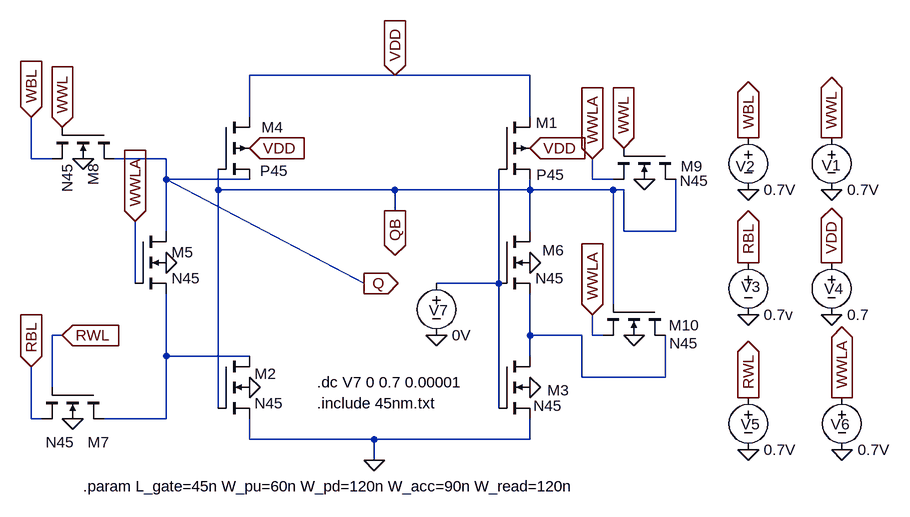
[diagram p0: schematic SNM_Test.asc]
SNM_Test.asc, the LTspice schematic file:
Version 4.1
SHEET 1 1680 680
WIRE 160 -32 -64 -32
WIRE 368 -32 160 -32
WIRE -64 32 -64 -32
WIRE 368 32 368 -32
WIRE -400 96 -400 32
WIRE -368 96 -400 96
WIRE -192 96 -272 96
WIRE -192 128 -192 96
WIRE -64 128 -192 128
WIRE 464 128 464 96
WIRE 496 128 464 128
WIRE -112 144 -112 112
WIRE 160 144 -112 144
WIRE 368 144 368 128
WIRE 368 144 160 144
WIRE 496 144 368 144
WIRE 512 144 496 144
WIRE 160 176 160 144
WIRE -192 208 -192 128
WIRE 368 208 368 144
WIRE 512 208 512 144
WIRE 592 208 592 128
WIRE 592 208 512 208
WIRE -240 288 -240 192
WIRE 112 288 -192 128
WIRE 320 288 320 112
WIRE 320 288 224 288
WIRE 496 320 496 144
WIRE -352 368 -368 368
WIRE 368 368 368 304
WIRE 448 368 368 368
WIRE 464 368 464 336
WIRE 480 368 464 368
WIRE -192 400 -192 304
WIRE -64 400 -192 400
WIRE 368 400 368 368
WIRE 448 432 448 368
WIRE 576 432 576 368
WIRE 576 432 448 432
WIRE -368 448 -368 368
WIRE -112 480 -112 144
WIRE 320 480 320 288
WIRE -400 496 -400 416
WIRE -384 496 -400 496
WIRE -192 496 -192 400
WIRE -192 496 -288 496
WIRE -64 528 -64 496
WIRE 128 528 -64 528
WIRE 368 528 368 496
WIRE 368 528 128 528
WIRE 128 560 128 528
FLAG -400 32 WBL
IOPIN -400 32 In
FLAG -400 416 RBL
IOPIN -400 416 In
FLAG -240 192 WWLA
IOPIN -240 192 In
FLAG 160 -32 VDD
IOPIN 160 -32 In
FLAG -352 48 WWL
IOPIN -352 48 In
FLAG -352 368 RWL
IOPIN -352 368 In
FLAG 128 560 0
FLAG 704 544 0
FLAG 848 544 0
FLAG 832 336 0
FLAG 704 336 0
FLAG 832 144 0
FLAG 704 144 0
FLAG 832 64 WWL
IOPIN 832 64 Out
FLAG 704 64 WBL
IOPIN 704 64 Out
FLAG 832 256 VDD
IOPIN 832 256 Out
FLAG 704 256 RBL
IOPIN 704 256 Out
FLAG 704 464 RWL
IOPIN 704 464 Out
FLAG 848 464 WWLA
IOPIN 848 464 Out
FLAG 160 176 QB
IOPIN 160 176 Out
FLAG 112 288 Q
IOPIN 112 288 Out
FLAG -320 96 0
FLAG -64 448 0
FLAG 368 448 0
FLAG 368 256 0
FLAG 528 368 0
FLAG 544 128 0
FLAG -336 496 0
FLAG -192 256 0
FLAG 224 368 0
FLAG 464 336 WWLA
IOPIN 464 336 In
FLAG 464 96 WWLA
IOPIN 464 96 In
FLAG 512 80 WWL
IOPIN 512 80 In
FLAG -64 80 VDD
IOPIN -64 80 In
FLAG 368 80 VDD
IOPIN 368 80 In
SYMBOL pmos4 320 32 R0
WINDOW 0 57 9 Left 2
WINDOW 3 58 89 Left 2
SYMATTR InstName M1
SYMATTR Value P45
SYMATTR Value2 l={L_gate} w={W_pu}
SYMBOL nmos4 320 400 R0
WINDOW 0 75 52 Left 2
WINDOW 3 53 76 Left 2
SYMATTR InstName M3
SYMATTR Value N45
SYMATTR Value2 l={L_gate} w={W_pd}
SYMBOL nmos4 -240 208 R0
SYMATTR InstName M5
SYMATTR Value N45
SYMATTR Value2 l={L_gate} w={W_acc}
SYMBOL nmos4 320 208 R0
WINDOW 0 67 29 Left 2
SYMATTR InstName M6
SYMATTR Value N45
SYMATTR Value2 l={L_gate} w={L_gate}
SYMBOL nmos4 -288 448 R90
WINDOW 0 84 -9 VRight 2
WINDOW 3 84 45 VRight 2
SYMATTR InstName M7
SYMATTR Value N45
SYMATTR Value2 l={L_gate} w={W_read}
SYMBOL nmos4 -272 48 R90
SYMATTR InstName M8
SYMATTR Value N45
SYMATTR Value2 l={L_gate} w={W_acc}
SYMBOL nmos4 592 80 R90
WINDOW 0 28 -42 VRight 2
WINDOW 3 50 -51 VRight 2
SYMATTR InstName M9
SYMATTR Value N45
SYMATTR Value2 l={L_gate} w={W_acc}
SYMBOL nmos4 576 320 R90
WINDOW 0 32 -53 VRight 2
WINDOW 3 60 -51 VRight 2
SYMATTR InstName M10
SYMATTR Value N45
SYMATTR Value2 l={L_gate} w={W_read}
SYMBOL nmos4 -112 400 R0
WINDOW 0 56 27 Left 2
SYMATTR InstName M2
SYMATTR Value N45
SYMATTR Value2 l={L_gate} w={W_pd}
SYMBOL pmos4 -112 32 R0
WINDOW 0 67 16 Left 2
WINDOW 3 64 83 Left 2
SYMATTR InstName M4
SYMATTR Value P45
SYMATTR Value2 l={L_gate} w={W_pu}
SYMBOL voltage 832 48 R0
WINDOW 0 -15 58 Left 2
SYMATTR InstName V1
SYMATTR Value 0.7V
SYMBOL voltage 704 48 R0
WINDOW 123 0 0 Left 0
WINDOW 39 0 0 Left 0
WINDOW 0 -19 60 Left 2
SYMATTR InstName V2
SYMATTR Value 0.7V
SYMBOL voltage 704 240 R0
WINDOW 0 -11 53 Left 2
SYMATTR InstName V3
SYMATTR Value 0.7v
SYMBOL voltage 832 240 R0
WINDOW 123 0 0 Left 0
WINDOW 39 0 0 Left 0
WINDOW 0 -11 56 Left 2
SYMATTR InstName V4
SYMATTR Value 0.7
SYMBOL voltage 704 448 R0
WINDOW 123 0 0 Left 0
WINDOW 39 0 0 Left 0
WINDOW 0 -12 57 Left 2
SYMATTR InstName V5
SYMATTR Value 0.7V
SYMBOL voltage 848 448 R0
WINDOW 123 0 0 Left 0
WINDOW 39 0 0 Left 0
WINDOW 0 -17 57 Left 2
SYMATTR InstName V6
SYMATTR Value 0.7V
SYMBOL voltage 224 272 R0
WINDOW 0 -12 57 Left 2
SYMATTR InstName V7
SYMATTR Value 0V
TEXT 40 472 Left 2 !.include 45nm.txt
TEXT -320 600 Left 2 !.param L_gate=45n W_pu=60n W_pd=120n W_acc=90n W_read=120n
TEXT 40 440 Left 2 !.dc V7 0 0.7 0.00001

The netlist it stands for:
* SNM_Test.asc
M1 VDD N001 QB VDD P45 l={L_gate} w={W_pu}
M3 N002 N001 0 0 N45 l={L_gate} w={W_pd}
M5 Q WWLA N003 0 N45 l={L_gate} w={W_acc}
M6 QB N001 N002 0 N45 l={L_gate} w={L_gate}
M7 N003 RWL RBL 0 N45 l={L_gate} w={W_read}
M8 Q WWL WBL 0 N45 l={L_gate} w={W_acc}
M9 QB WWL WWLA 0 N45 l={L_gate} w={W_acc}
M10 N002 QB WWLA 0 N45 l={L_gate} w={W_read}
M2 N003 QB 0 0 N45 l={L_gate} w={W_pd}
M4 VDD QB Q VDD P45 l={L_gate} w={W_pu}
V1 WWL 0 0.7V
V2 WBL 0 0.7V
V3 RBL 0 0.7v
V4 VDD 0 0.7
V5 RWL 0 0.7V
V6 WWLA 0 0.7V
V7 N001 0 0V
.model NMOS NMOS
.model PMOS PMOS
.lib standard.mos
.include 45nm.txt
.param L_gate=45n W_pu=60n W_pd=120n W_acc=90n W_read=120n
.dc V7 0 0.7 0.00001
.backanno
.end